# Altium schematic sheet VT_BANK.SchDoc
size B
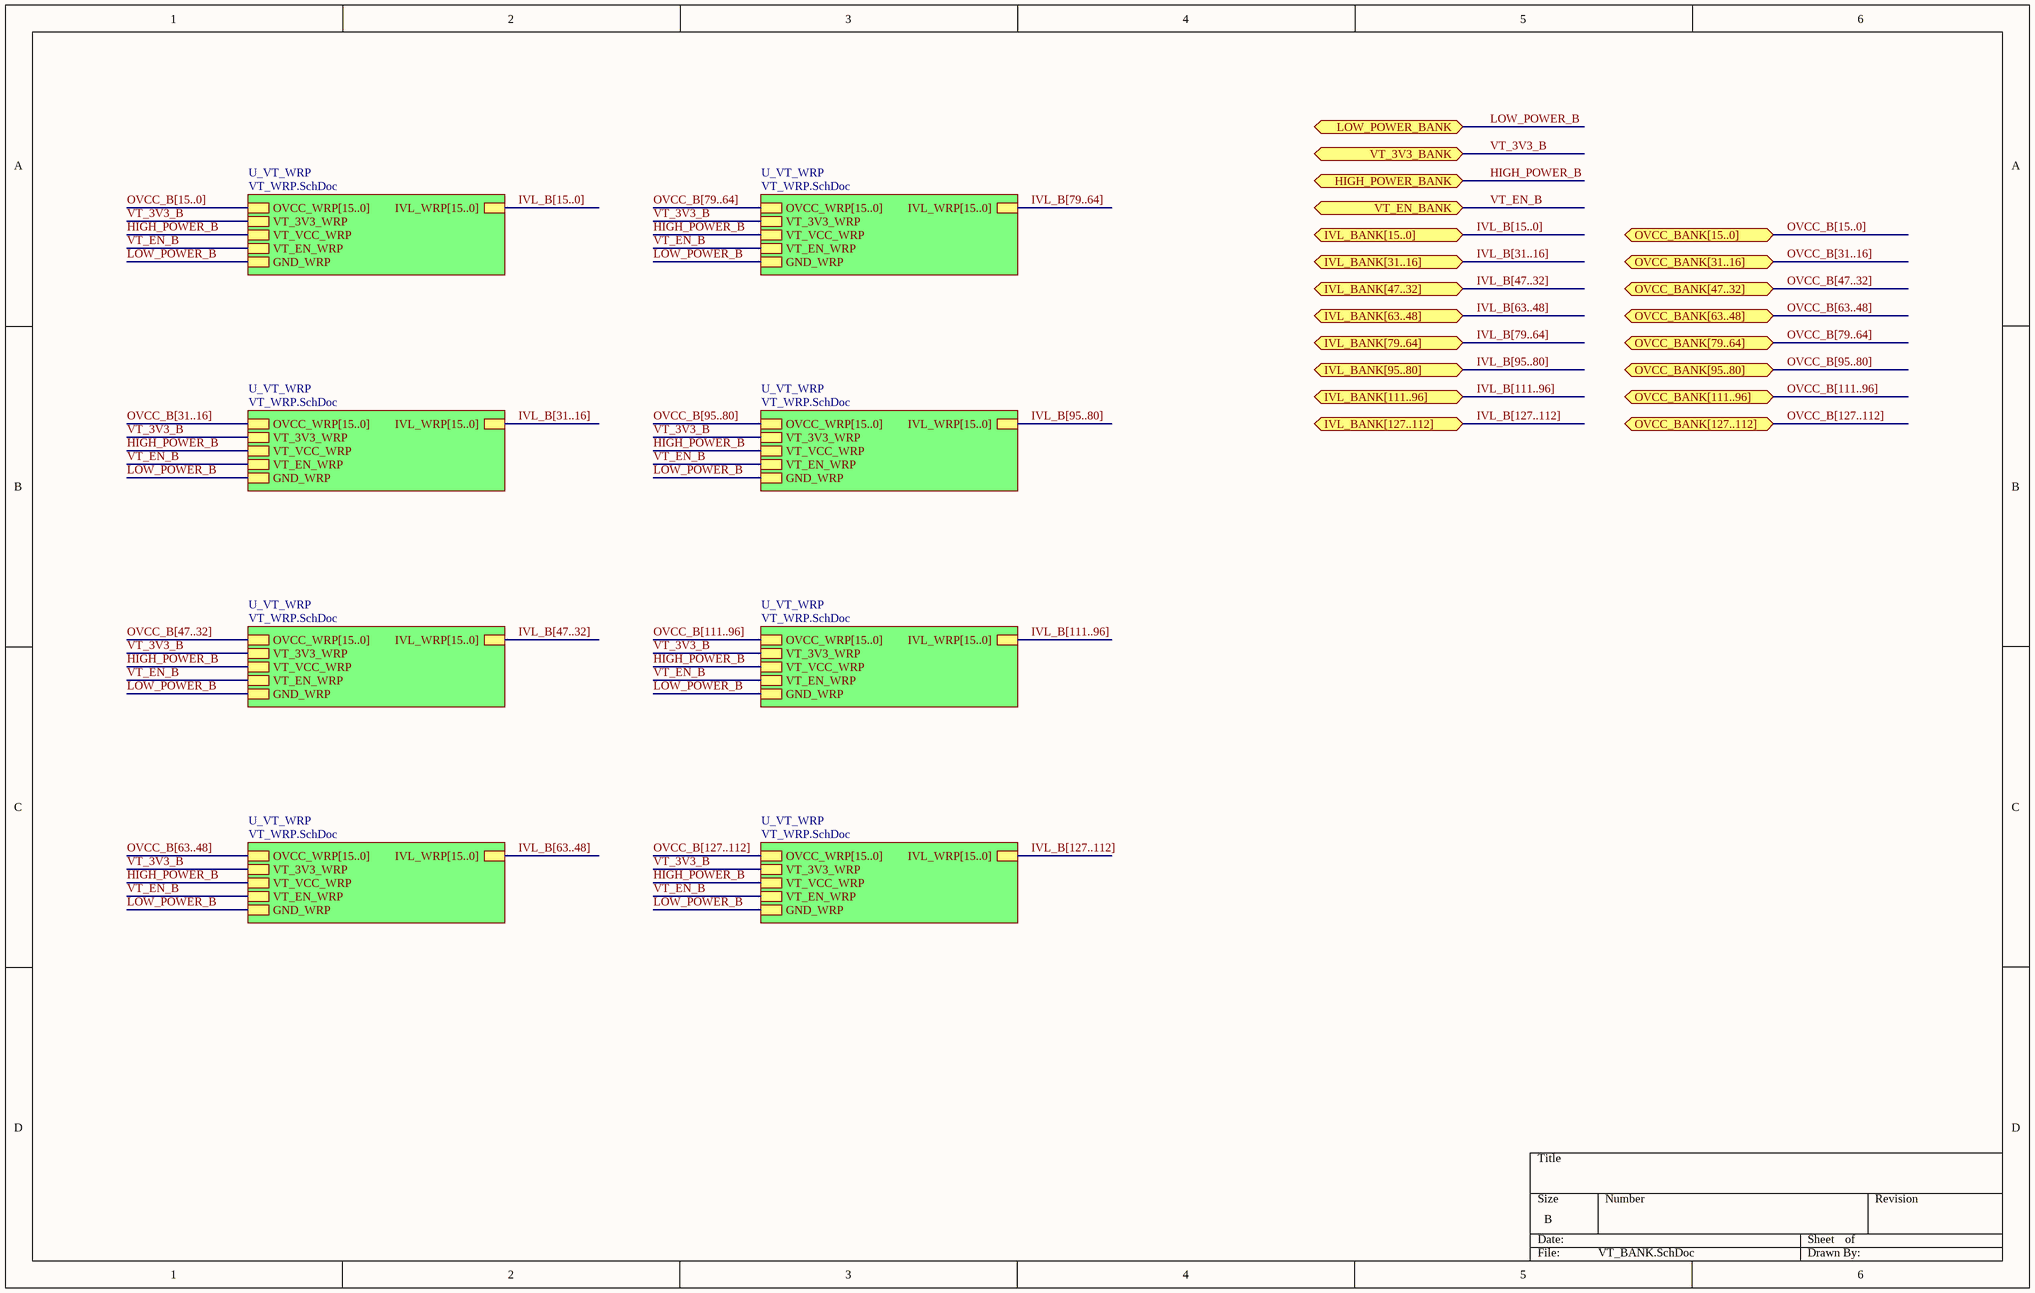
[diagram p0: VT_BANK.SchDoc]

## Sub-sheets
U_VT_WRP = VT_WRP.SchDoc: OVCC_WRP[15..0], IVL_WRP[15..0], VT_3V3_WRP, VT_VCC_WRP, VT_EN_WRP, GND_WRP
U_VT_WRP = VT_WRP.SchDoc: OVCC_WRP[15..0], IVL_WRP[15..0], VT_3V3_WRP, VT_VCC_WRP, VT_EN_WRP, GND_WRP
U_VT_WRP = VT_WRP.SchDoc: OVCC_WRP[15..0], IVL_WRP[15..0], VT_3V3_WRP, VT_VCC_WRP, VT_EN_WRP, GND_WRP
U_VT_WRP = VT_WRP.SchDoc: OVCC_WRP[15..0], IVL_WRP[15..0], VT_3V3_WRP, VT_VCC_WRP, VT_EN_WRP, GND_WRP
U_VT_WRP = VT_WRP.SchDoc: OVCC_WRP[15..0], IVL_WRP[15..0], VT_3V3_WRP, VT_VCC_WRP, VT_EN_WRP, GND_WRP
U_VT_WRP = VT_WRP.SchDoc: OVCC_WRP[15..0], IVL_WRP[15..0], VT_3V3_WRP, VT_VCC_WRP, VT_EN_WRP, GND_WRP
U_VT_WRP = VT_WRP.SchDoc: OVCC_WRP[15..0], IVL_WRP[15..0], VT_3V3_WRP, VT_VCC_WRP, VT_EN_WRP, GND_WRP
U_VT_WRP = VT_WRP.SchDoc: OVCC_WRP[15..0], IVL_WRP[15..0], VT_3V3_WRP, VT_VCC_WRP, VT_EN_WRP, GND_WRP

## Ports
HIGH_POWER_BANK, IVL_BANK[15..0], IVL_BANK[31..16], IVL_BANK[47..32], IVL_BANK[63..48], IVL_BANK[79..64], IVL_BANK[95..80], IVL_BANK[111..96], IVL_BANK[127..112], LOW_POWER_BANK, OVCC_BANK[15..0], OVCC_BANK[31..16], OVCC_BANK[47..32], OVCC_BANK[63..48], OVCC_BANK[79..64], OVCC_BANK[95..80], OVCC_BANK[111..96], OVCC_BANK[127..112], VT_3V3_BANK, VT_EN_BANK

## Nets
HIGH_POWER_B: port HIGH_POWER_BANK, sheet U_VT_WRP/VT_VCC_WRP, sheet U_VT_WRP/VT_VCC_WRP, sheet U_VT_WRP/VT_VCC_WRP, sheet U_VT_WRP/VT_VCC_WRP, sheet U_VT_WRP/VT_VCC_WRP, sheet U_VT_WRP/VT_VCC_WRP, sheet U_VT_WRP/VT_VCC_WRP, sheet U_VT_WRP/VT_VCC_WRP
LOW_POWER_B: port LOW_POWER_BANK, sheet U_VT_WRP/GND_WRP, sheet U_VT_WRP/GND_WRP, sheet U_VT_WRP/GND_WRP, sheet U_VT_WRP/GND_WRP, sheet U_VT_WRP/GND_WRP, sheet U_VT_WRP/GND_WRP, sheet U_VT_WRP/GND_WRP, sheet U_VT_WRP/GND_WRP
VT_3V3_B: port VT_3V3_BANK, sheet U_VT_WRP/VT_3V3_WRP, sheet U_VT_WRP/VT_3V3_WRP, sheet U_VT_WRP/VT_3V3_WRP, sheet U_VT_WRP/VT_3V3_WRP, sheet U_VT_WRP/VT_3V3_WRP, sheet U_VT_WRP/VT_3V3_WRP, sheet U_VT_WRP/VT_3V3_WRP, sheet U_VT_WRP/VT_3V3_WRP
VT_EN_B: port VT_EN_BANK, sheet U_VT_WRP/VT_EN_WRP, sheet U_VT_WRP/VT_EN_WRP, sheet U_VT_WRP/VT_EN_WRP, sheet U_VT_WRP/VT_EN_WRP, sheet U_VT_WRP/VT_EN_WRP, sheet U_VT_WRP/VT_EN_WRP, sheet U_VT_WRP/VT_EN_WRP, sheet U_VT_WRP/VT_EN_WRP

## Buses and harness runs
bus IVL_B[15..0] = port IVL_BANK[15..0]
bus IVL_B[15..0] = sheet U_VT_WRP/IVL_WRP[15..0]
bus IVL_B[31..16] = port IVL_BANK[31..16]
bus IVL_B[31..16] = sheet U_VT_WRP/IVL_WRP[15..0]
bus IVL_B[47..32] = port IVL_BANK[47..32]
bus IVL_B[47..32] = sheet U_VT_WRP/IVL_WRP[15..0]
bus IVL_B[63..48] = port IVL_BANK[63..48]
bus IVL_B[63..48] = sheet U_VT_WRP/IVL_WRP[15..0]
bus IVL_B[79..64] = port IVL_BANK[79..64]
bus IVL_B[79..64] = sheet U_VT_WRP/IVL_WRP[15..0]
bus IVL_B[95..80] = port IVL_BANK[95..80]
bus IVL_B[95..80] = sheet U_VT_WRP/IVL_WRP[15..0]
bus IVL_B[111..96] = port IVL_BANK[111..96]
bus IVL_B[111..96] = sheet U_VT_WRP/IVL_WRP[15..0]
bus IVL_B[127..112] = port IVL_BANK[127..112]
bus IVL_B[127..112] = sheet U_VT_WRP/IVL_WRP[15..0]
bus OVCC_B[15..0] = port OVCC_BANK[15..0]
bus OVCC_B[15..0] = sheet U_VT_WRP/OVCC_WRP[15..0]
bus OVCC_B[31..16] = port OVCC_BANK[31..16]
bus OVCC_B[31..16] = sheet U_VT_WRP/OVCC_WRP[15..0]
bus OVCC_B[47..32] = port OVCC_BANK[47..32]
bus OVCC_B[47..32] = sheet U_VT_WRP/OVCC_WRP[15..0]
bus OVCC_B[63..48] = port OVCC_BANK[63..48]
bus OVCC_B[63..48] = sheet U_VT_WRP/OVCC_WRP[15..0]
bus OVCC_B[79..64] = port OVCC_BANK[79..64]
bus OVCC_B[79..64] = sheet U_VT_WRP/OVCC_WRP[15..0]
bus OVCC_B[95..80] = port OVCC_BANK[95..80]
bus OVCC_B[95..80] = sheet U_VT_WRP/OVCC_WRP[15..0]
bus OVCC_B[111..96] = port OVCC_BANK[111..96]
bus OVCC_B[111..96] = sheet U_VT_WRP/OVCC_WRP[15..0]
bus OVCC_B[127..112] = port OVCC_BANK[127..112]
bus OVCC_B[127..112] = sheet U_VT_WRP/OVCC_WRP[15..0]